# EAGLE design SpinningDiscPCB (EAGLE 8.5.1)
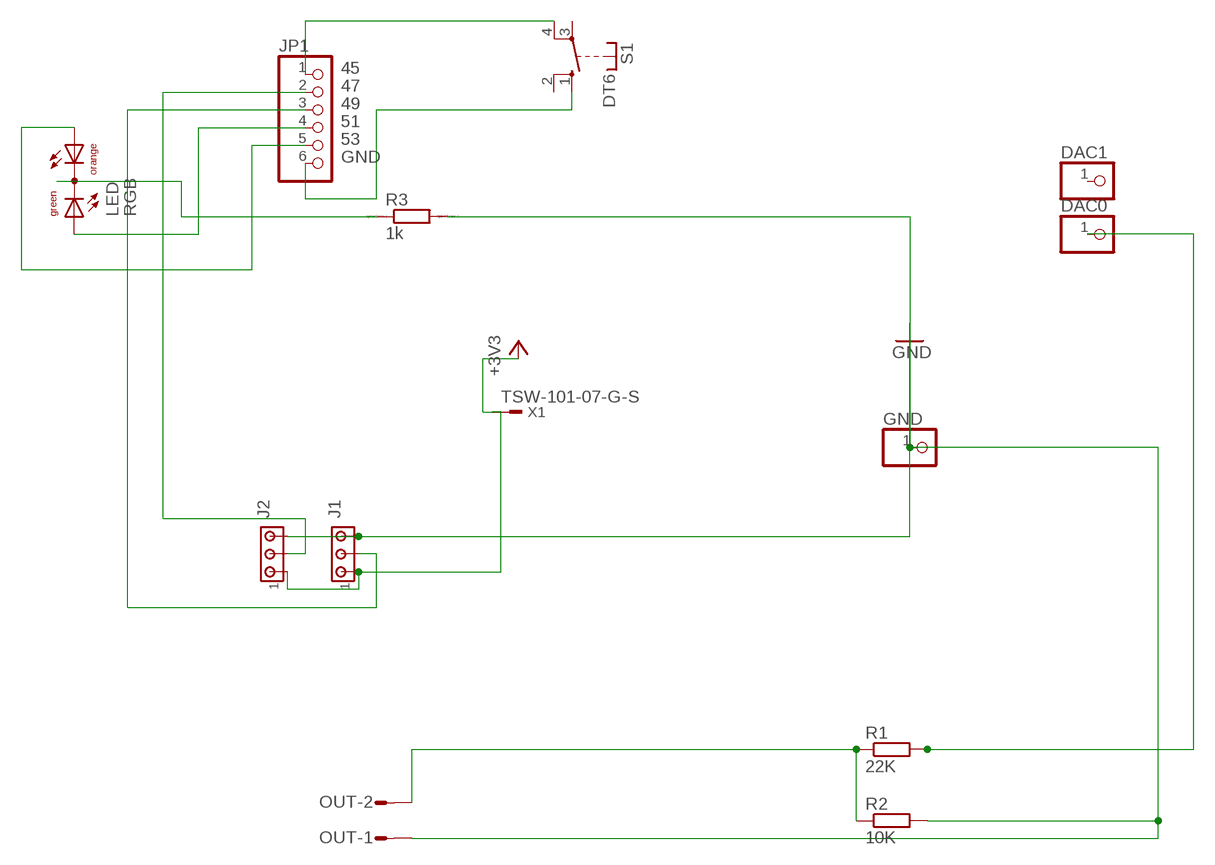
[diagram p0: schematic, sheet 1]

## Parts
DAC0  PINHD-1X1  [1X01]
DAC1  PINHD-1X1  [1X01]
GND  PINHD-1X1  [1X01]
J1  MTA03-100  [10X03MTA]
J2  MTA03-100  [10X03MTA]
JP1  PINHD-1X6  [1X06]
LED  RGB  TLUV5300  [TLUV5300]
OUT  L02P  [L02P]
R1  22K  R-EU_0207/10  [0207/10]
R2  10K  R-EU_0207/10  [0207/10]
R3  1k  R0207/10  [0207/10]
S1  DT6  [DT6]
X1  TSW-101-07-G-S  [TSW-101-XX-G-S]

## Nets
45: JP1.1 S1.4(P)
47: J2.2 JP1.2
49: J1.2 JP1.3
51: JP1.4 LED.AG
53: JP1.5 LED.AO
+3V3: J1.1 J2.1 X1.1
GND: GND.1 J1.3 J2.3 LED.CC OUT.1 R2.2 R3.1 R3.2
N$1: JP1.6 S1.1(S)
N$4: DAC0.1 R1.2
N$5: OUT.2 R1.1 R2.1
Unconnected: DAC1.1 S1.2(S) S1.3(P)

## Library data of the parts
DAC0 DAC1 GND = pinhead:PINHD-1X1: PIN HEADER
J1 J2 = con-amp:MTA03-100: AMP connector
JP1 = pinhead:PINHD-1X6: PIN HEADER
LED = led:TLUV5300: Bicolor LED 5 mm Untinted Diffused Package Source: www.vishay.com .. Bi-Color LED Vashay TLUV5300.pdf
OUT = con-amp-mt:L02P: AMP MT CONNECTOR; OC_FARNELL: unknown; OC_NEWARK: unknown
R1 R2 = rcl:R-EU_: RESISTOR, European symbol; SPICEPREFIX: R
R3 = eagle-ltspice:R: RESISTOR, European symbol; SPICEMODEL: NONE; SPICEPREFIX: R
S1 = switch-misc:DT: ITT SWITCH
X1 = con-samtec:TSW-101-*-G-S: THROUGH-HOLE .025" SQ POST HEADER Source: Samtec TSW.pdf; MF: Samtec Inc.; MPN: TSW-101-07-G-S

## Board
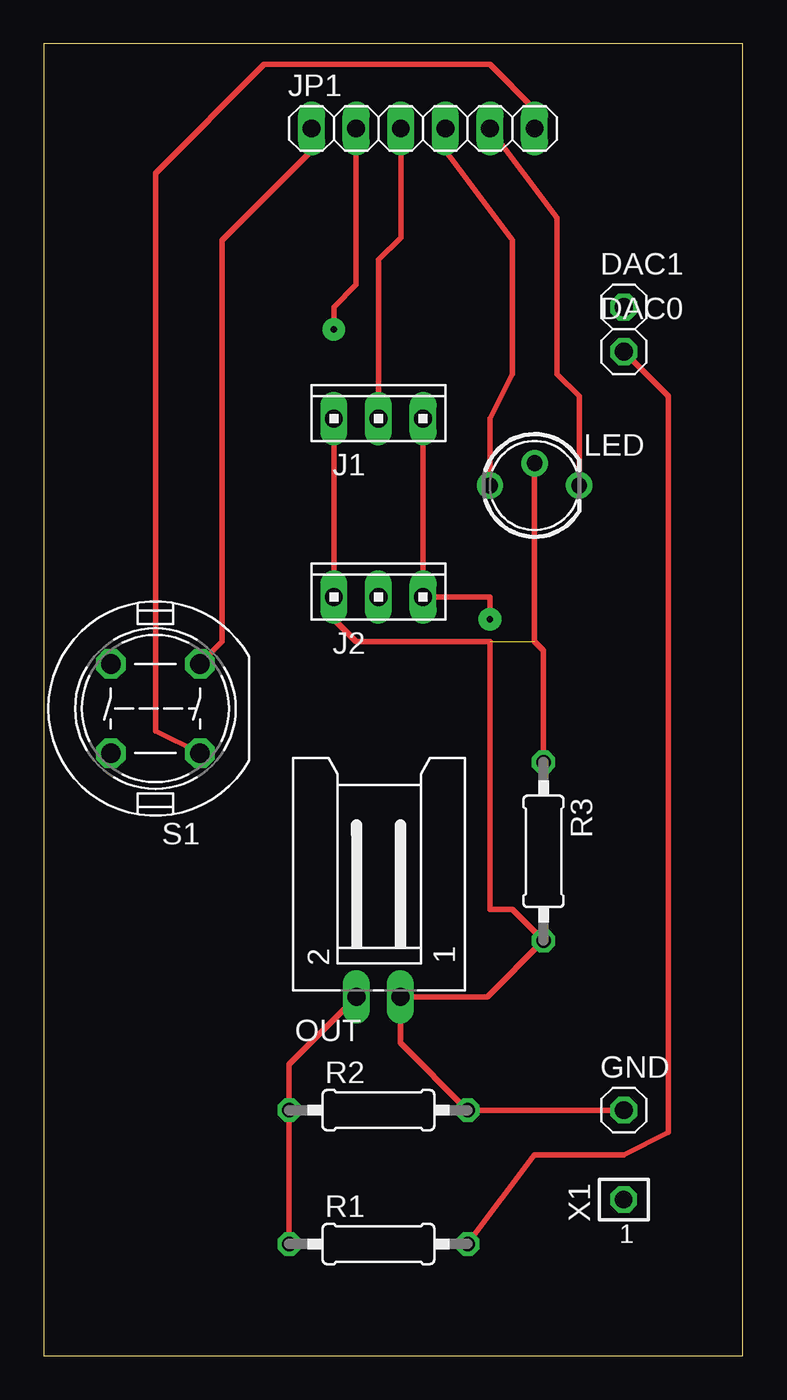
[diagram p1: board, top side]
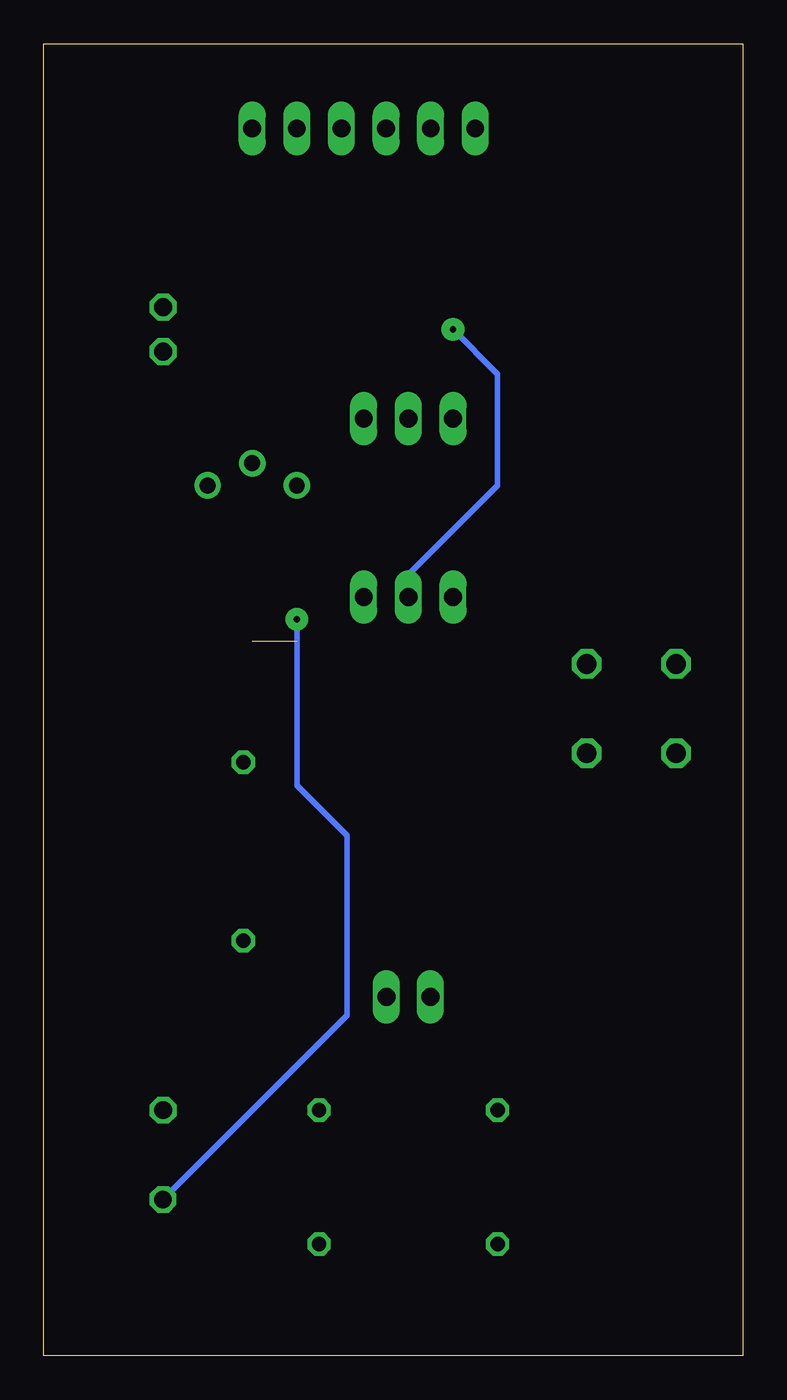
[diagram p2: board, bottom side, seen from below]

Size 39.8 x 74.67 mm. Coordinates in mm from the lower left corner, seen from the top.
Outline: 0,0 39.8,0 39.8,74.67 0,74.67 0,0
Copper layers (1*16): Top 0.035mm / dielectric 1.5mm / Bottom 0.035mm
Design rules "default": minimum track width 6mil, minimum drill 0.35mm, track to track 6mil, track to pad 6mil, pad to pad 6mil, via to via 6mil, smd to smd 6mil, copper to edge 40mil, drill to drill 6mil, minimum pad ring 10mil, minimum via ring 8mil, stop-mask expansion 4mil, vias tented up to drill 0mil, thermal gap 10mil

### Footprints (pad centres in the part's own frame; a part is rotated, then mirrored left to right if it is on the bottom)
1X01 = drill 1.016 octagon: 1 0,0
10X03MTA = drill 1.016 long: 1 2.54,0; 2 0,0; 3 -2.54,0
1X06 = drill 1.016 long: 1 -6.35,0; 2 -3.81,0; 3 -1.27,0; 4 1.27,0; 5 3.81,0; 6 6.35,0
TLUV5300 = drill 0.9 pad 1.5: AG 2.54,0; AO -2.54,0; CC 0,-1.27
L02P = drill 1.016 long: 1 1.25,-6.25; 2 -1.25,-6.25
0207/10 = drill 0.813 octagon: 1 -5.08,0; 2 5.08,0
DT6 = drill 1.118 octagon: 1 -2.54,2.54; 2 2.54,2.54; 3 2.54,-2.54; 4 -2.54,-2.54
TSW-101-XX-G-S = drill 1 pad 1.5 octagon: 1 0,0

### Placement (x,y rotation side)
DAC0  33.02,57.15 0 top
DAC1  33.02,59.69 0 top
GND  33.02,13.97 0 top
J1  19.05,53.34 0 top
J2  19.05,43.18 0 top
JP1  21.59,69.85 0 top
LED  27.94,49.53 180 top
OUT  19.05,26.67 0 top
R1  19.05,6.35 0 top
R2  19.05,13.97 0 top
R3  28.45,28.7 270 top
S1  6.35,36.83 180 top
X1  33.02,8.89 0 top

### Tracks (layer width: path | path; a pad name or v marks a point on that pad's centre or on a via)
45
  Top 0.3: S1.4 10.16,40.64 10.16,63.5 15.24,68.58 JP1.1
47  (via drill 0.35 pad 1.3)
  Top 0.3: v16.51,58.42 16.51,59.69 17.78,60.96 JP1.2
  Bottom 0.3: J2.2 19.05,44.45 13.97,49.53 13.97,55.88 v16.51,58.42
49
  Top 0.3: JP1.3 20.32,63.65 19.05,62.38 J1.2
51
  Top 0.3: LED.AG 25.4,53.34 26.67,55.88 26.67,63.5 22.86,68.58 JP1.4
53
  Top 0.3: JP1.5 29.21,64.77 29.21,55.88 30.48,54.61 LED.AO
+3V3  (via drill 0.35 pad 1.3)
  Top 0.3: J1.1 J2.1 25.4,43.18 v25.4,41.91
  Bottom 0.3: X1.1 22.54,19.37 22.54,29.61 25.4,32.46 v25.4,41.91
GND  (1 unrouted)
  Top 0.3: GND.1 R2.2 20.3,17.8 OUT.1 25.25,20.42 R3.2 26.67,25.4 25.4,25.4 25.4,40.64 17.78,40.64 16.51,41.91 J2.3 J1.3 | R3.1 28.45,40.13 27.94,40.64 LED.CC
N$1
  Top 0.3: JP1.6 27.94,70.96 25.4,73.5 12.54,73.5 6.35,67.31 6.35,35.56 S1.1
N$4
  Top 0.3: R1.2 27.94,11.43 33.02,11.43 35.56,12.7 35.56,54.61 DAC0.1
N$5
  Top 0.3: R1.1 R2.1 13.97,16.59 OUT.2